# EAGLE design yin_bit (EAGLE 9.4.2)
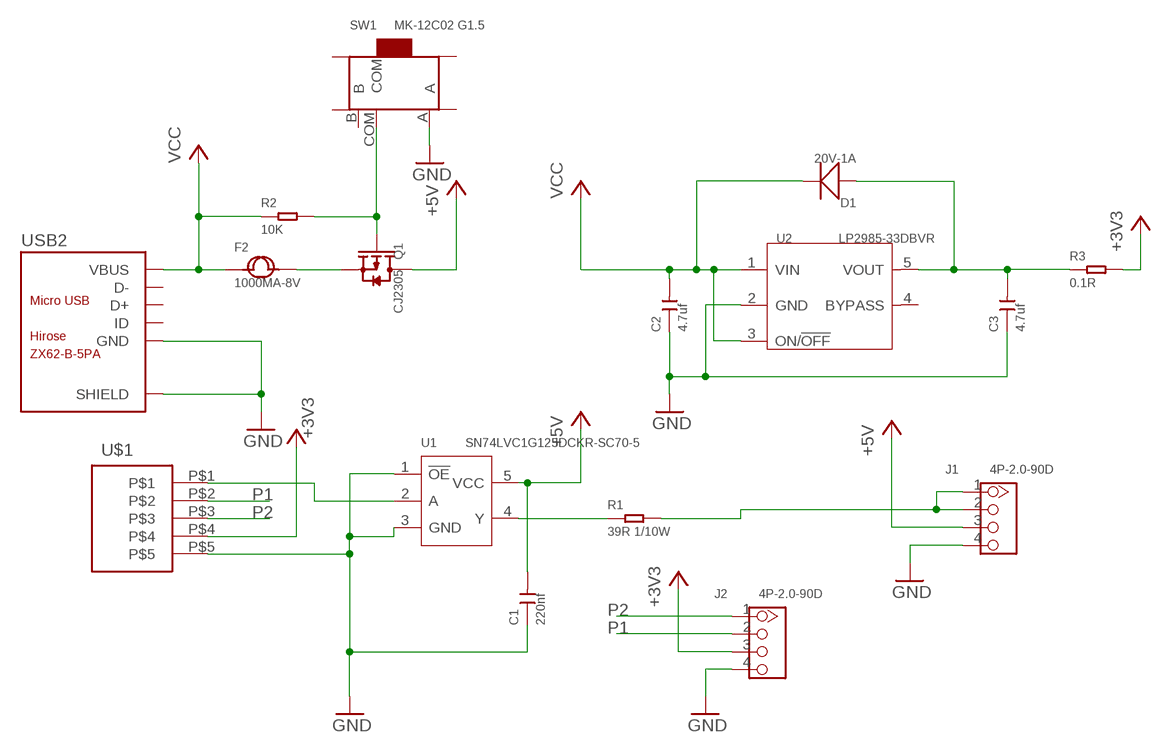
[diagram p0: schematic, sheet 1]

## Parts
C1  220nf  CERAMIC-220NF-25V-10%-X7R(0603)  [C0603]
C2  4.7uf  CERAMIC-4.7UF-10V-10%-X5R(0603)  [C0603]
C3  4.7uf  CERAMIC-4.7UF-10V-10%-X5R(0603)  [C0603]
D1  20V-1A  SMD-DIODE-SCHOTTKY-20V-1A(SOD-123)  [SOD-123]
F2  1000MA-8V  SMD-PPTC-1000MA-8V(1206)  [F1206]
J1  4P-2.0-90D  GROVE-CONNECTOR-DIP-90D(4P-2.0)  [HW4-2.0-90D]
J2  4P-2.0-90D  GROVE-CONNECTOR-DIP-90D(4P-2.0)  [HW4-2.0-90D]
Q1  CJ2305  SMD-MOSFET-P-CH-8V-4.1A-CJ2305(SOT-23)  [SOT-23]
R1  39R 1/10W  SMD-RES-39R-5%-1/10W(0603)  [R0603]
R2  10K  SMD-RES-10K-1%-1/10W(0603)  [R0603]
R3  0.1R  SMD-RES-0.1R-5%-1/8W(0805)  [R0805]
SW1  MK-12C02 G1.5  SMD-TOGGLE-SWITCH-ON-ON(3+4P-6.7X2.7MM)  [SW7-SMD-L6.7X2.7X3.2MM]
U1  SN74LVC1G125DCKR-SC70-5  LOGIC-SN74LVC1G125DCKR(SC70-5)  [SC-70-5]
U2  LP2985-33DBVR  PMIC-LP2985-33DBVR(SOT23-5)  [SOT-23-5]
U$1  MICROBIT-HOLL  [MICROBIT-HOLL]
USB2  ZX62-B-5PA  MICRO-USB-SMD(ZX62-B-5PA)  [MICRO-USB5+6P-SMD-0.65-AB]

## Nets
+3V3: J2.3 R3.2 U$1.P$4
+5V: C1.2 J1.3 Q1.3(D) U1.5(VCC)
GND: C1.1 C2.1 C3.1 J1.4 J2.4 SW1.A U1.1(!OE!) U1.3(GND) U2.2(GND) U$1.P$5 USB2.5(GND) USB2.P1(SHIELD) USB2.P2(SHIELD) USB2.P3(SHIELD) USB2.P4(SHIELD) USB2.P5(SHIELD) USB2.P6(SHIELD)
N$1: U1.2(A) U$1.P$1
N$2: R1.1 U1.4(Y)
N$3: J1.1 J1.2 R1.2
N$4: Q1.1(G) R2.2 SW1.COM
N$5: F2.2 Q1.2(S)
N$6: C3.2 D1.+ R3.1 U2.5(VOUT)
P1: J2.2 U$1.P$2
P2: J2.1 U$1.P$3
VCC: C2.2 D1.- F2.1 R2.1 U2.1(VIN) U2.3(ON/!OFF) USB2.1(VBUS)
Unconnected: SW1.B SW1.SS1 SW1.SS2 SW1.SS3 SW1.SS4 U2.4(BYPASS) USB2.2(D-) USB2.3(D+) USB2.4(ID)

## Library data of the parts
C1 = Seeed-Capacitor:CERAMIC-220NF-25V-10%-X7R(0603): 302010073; MPN: CC0603KRX7R8BB224
C2 C3 = Seeed-Capacitor:CERAMIC-4.7UF-10V-10%-X5R(0603): 302010111; MPN: CC0603KRX5R6BB475
D1 = Seeed-Diode:SMD-DIODE-SCHOTTKY-20V-1A(SOD-123): 304020034; MPN: B5819W
F2 = Seeed-Fuse:SMD-PPTC-1000MA-8V(1206): 307010001; MPN: KT8-1000SMD1206
J1 J2 = Seeed-Connector:GROVE-CONNECTOR-DIP-90D(4P-2.0): 320110034
Q1 = Seeed-Transistor:SMD-MOSFET-P-CH-8V-4.1A-CJ2305(SOT-23): 305030014; MPN: CJ2305
R1 = Seeed-OPL-Resistor:SMD-RES-39R-5%-1/10W(0603): 301010138; MPN: RC0603JR-0739RL
R2 = Seeed-Resistor:SMD-RES-10K-1%-1/10W(0603): 301010299; MPN: RC0603FR-0710KL
R3 = Seeed-Resistor:SMD-RES-0.1R-5%-1/8W(0805): 301010264; MPN: RL0805JR-070R1L
SW1 = Seeed-Switch:SMD-TOGGLE-SWITCH-ON-ON(3+4P-6.7X2.7MM): 311030001; MPN: MK-12C02 G1.5
U1 = Seeed-OPL-ic:LOGIC-SN74LVC1G125DCKR(SC70-5): 310050019; MPN: SN74LVC1G125DCKR
U2 = Seeed-OPL-ic:PMIC-LP2985-33DBVR(SOT23-5): 310030033; MPN: LP2985-33DBVR
U$1 = Seeed-Connector:MICROBIT-HOLL
USB2 = Seeed-OPL-Connector:MICRO-USB-SMD(ZX62-B-5PA): 320010005; MPN: ZX62-B-5PA

## Board
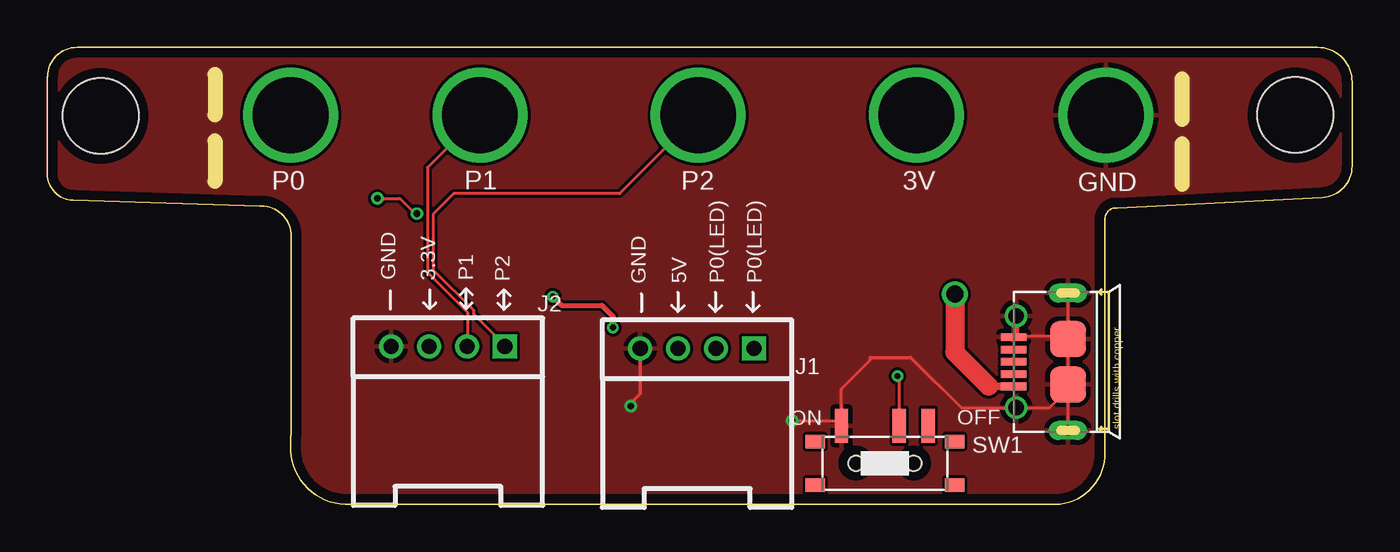
[diagram p1: board, top side]
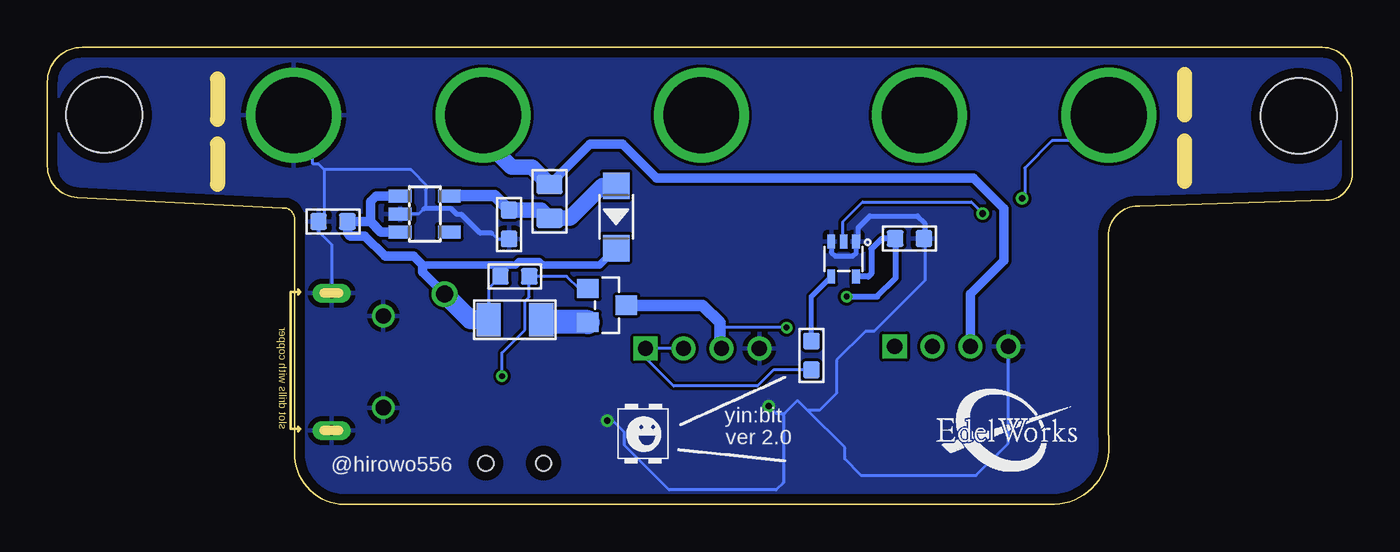
[diagram p2: board, bottom side, seen from below]

Size 68.89 x 24.15 mm. Coordinates in mm from the lower left corner, seen from the top.
Outline: 55.85,14.14 55.85,15.1 arc-90 56.42,15.66 56.51,15.66 67.33,16.22 arc87 68.9,17.87 68.9,22.32 arc90 67.07,24.15 1.57,24.15 arc90 0.01,22.59
Outline: 12.87,14.19 arc90 11.31,15.75 11.2,15.75 1.35,16.07 arc-88 0,17.46 0,22.6 0.02,22.6
Outline: 12.87,14.17 12.87,3.65
Outline: 12.86,3.65 12.86,3.09 arc90 15.72,0 53.22,0
Outline: 55.85,14.12 55.85,2.74 arc-90 53.22,0
Copper layers (1*16): Top 0.035mm / dielectric 1.6mm / Bottom 0.035mm
Design rules "Elecrow_2-layer_PCB_eagle_rule": minimum track width 6mil, minimum drill 12mil, track to track 6mil, track to pad 6mil, pad to pad 6mil, via to via 8mil, smd to smd 0mil, copper to edge 20mil, drill to drill 10mil, minimum pad ring 6mil, minimum via ring 6mil, stop-mask expansion 0mil, vias tented up to drill 100mil, thermal gap 10mil
Holes 4 mm at 2.81,20.52 65.89,20.57
Milling: 4 lines

### Footprints (pad centres in the part's own frame; a part is rotated, then mirrored left to right if it is on the bottom)
C0603 = smd 0.889 x 0.889: 1 0,0.762; 2 0,-0.762
SOD-123 = smd 1.397 x 1.397: + -1.651,0; - 1.651,0
F1206 = smd 1.27 x 1.778: 1 -1.397,0; 2 1.397,0
HW4-2.0-90D = drill 0.8 pad 1.27 square: 1 -3,0 | drill 0.8 pad 1.27: 2 -1,0; 3 1,0; 4 3,0
SOT-23 = smd 1.016 x 1.143: 1 -0.889,-1.016; 2 0.889,-1.016; 3 0,1.016
R0603 = smd 0.889 x 0.889: 1 0,0.762; 2 0,-0.762
R0805 = smd 1.397 x 1.016: 1 0,0.889; 2 0,-0.889
SW7-SMD-L6.7X2.7X3.2MM = smd 1.8 x 0.7: A 1.978,2.286; B 1.978,-2.286; COM 1.978,-0.762 | smd 0.7 x 1.016: SS1 -1.15,-3.683; SS2 1.15,-3.683; SS3 1.15,3.683; SS4 -1.15,3.683 | hole 0.813: 0,-1.524; 0,1.524
SC-70-5 = smd 0.4 x 0.75: 1 -0.65,-0.925; 2 0,-0.925; 3 0.65,-0.925; 4 0.65,0.925; 5 -0.65,0.925
SOT-23-5 = smd 0.69 x 1.2: 1 -0.95,-1.3; 2 0,-1.3; 3 0.95,-1.3; 4 0.95,1.3; 5 -0.95,1.3
MICROBIT-HOLL = drill 4: P$1 -11.43,0; P$2 -1.43,0; P$3 10.094,0; P$4 21.618,0; P$5 31.618,0
MICRO-USB5+6P-SMD-0.65-AB = smd 0.4 x 1.35: 1 -1.3,2.875; 2 -0.65,2.875; 3 0,2.875; 4 0.65,2.875; 5 1.3,2.875 | smd 1.9 x 1.9: P1 -1.2,0; P2 1.2,0 | drill 0.508 pad 1.016 long: P3 -3.625,0; P4 3.625,0 | drill 0.8: P5 -2.425,2.73; P6 2.425,2.73

### Placement (x,y rotation side)
C1  23.37,14.04 270 bottom
C2  53.81,14.94 90 bottom
C3  44.52,14.79 180 bottom
D1  38.86,15.19 270 bottom
F2  44.21,9.76 0 bottom
J1  34.31,8.23 180 top
J2  21.16,8.34 180 top
Q1  39.33,10.52 270 bottom
R1  28.55,7.86 0 bottom
R2  44.21,12.04 90 bottom
R3  42.38,16 180 bottom
SW1  44.22,2.17 90 top
U1  26.85,12.96 180 bottom
U2  48.97,15.34 270 bottom
U$1  24.27,20.56 0 top
USB2  53.89,7.53 90 top

### Tracks (layer width: path | path; a pad name or v marks a point on that pad's centre or on a via)
+3V3
  Bottom 0.508: R3.2 40.25,19.02 38.53,19.02 36.73,17.23 19.99,17.23 18.38,15.62 18.38,12.88 20.16,11.1 J2.3
  Bottom 0.813: U$1.P$4 45.89,19.31 44.39,17.81 43.3,17.81 R3.2
+5V  (via drill 0.3)
  Top 0.254: v26.69,10.98 27.14,10.52 29.28,10.52 29.87,9.93 v29.87,9.34
  Bottom 0.152: v29.87,9.34 33.2,9.34 33.39,9.15
  Bottom 0.305: v26.69,10.98 25.09,10.98 24.09,11.97 24.09,14.01 C1.2 24.84,14.04 25.39,13.49 25.39,12.19 25.55,12.04 U1.5
  Bottom 0.61: Q1.3 34.31,10.52 33.39,9.6 33.39,9.15 33.39,8.32 J1.3
GND  (via drill 0.35)
  Top 0.152: USB2.P2 53.89,8.69 | 53.89,8.69 USB2.P1 53.89,6.1 | 53.89,6.1 USB2.P3 | 53.89,6.1 52.9,5.11 USB2.P5 48.25,5.11 45.58,7.78 43.45,7.78 43.45,7.62 41.93,6.11 41.93,4.27 | 51.16,8.9 53.67,8.9 53.77,8.8 | 53.77,8.8 53.89,8.69 | USB2.P4 53.89,8.92 53.77,8.8 | SW1.A 41.93,4.27 | J1.4 31.31,5.84 30.8,5.34 v30.8,5.18 | v39.33,4.42 41.78,4.42 41.93,4.27
  Top 0.254: USB2.P6 51.16,8.9 51.08,8.9 USB2.5
  Bottom 0.152: U$1.P$5 54.88,20.28 54.88,17.99 54.57,17.99 54.27,17.68 | U2.2 49.29,15.34 49.01,15.62 48.94,15.7 48.94,16.61 48.78,16.77 49.7,17.68 54.27,17.68 | 45.43,14.33 45.13,14.02 C3.1 | 29.96,4.8 29.28,5.49 28.76,4.97 | 29.96,4.8 30.04,4.73 30.04,1.15 30.42,0.76 36.06,0.76 38.42,3.13 38.42,3.81 39.03,4.42 v39.33,4.42 | 54.27,17.68 54.27,15.24 C2.1 54.57,14.42 53.89,13.73 USB2.P4 | 28.76,4.97 26.79,3.01 26.79,2.4 25.92,1.53 19.86,1.53 18.16,3.23 J2.4 | 22.57,14.08 22.57,11.81 25.24,9.15 25.7,9.15 27.22,7.62 27.22,5.87 28.12,4.97 28.76,4.97 | v30.8,5.18 30.42,4.8 29.96,4.8
  Bottom 0.254: U1.1 26.19,13.87 | U1.3 27.5,13.32 27.3,13.11 26.38,13.11 26.19,13.3 26.19,13.87 | 45.43,14.33 46.04,14.33 47.03,15.32 47.26,15.32 47.57,15.62 49.01,15.62 | 26.19,13.87 26.08,13.98 26.08,14.63 25.47,15.24 22.95,15.24 22.57,14.86 22.57,14.08 C1.1
  pour Top: -2.42,-2.28 -2.42,24.84 70.73,24.84 70.73,-2.28
  pour Bottom: -2.42,-3.05 -2.42,24.84 71.49,24.84 71.49,-3.05
N$1  (via drill 0.35)
  Top 0.152: v17.42,16.16 18.62,16.16 19.42,15.36 v19.51,15.36
  Bottom 0.152: U$1.P$1 14.2,19.21 15.85,19.21 17.28,17.77 17.28,16.3 v17.42,16.16 | v19.51,15.36 20.11,15.97 25.85,15.97 26.9,14.92 26.9,13.94 U1.2
N$2
  Bottom 0.254: R1.1 28.55,10.99 U1.4
N$3
  Bottom 0.152: R1.2 30.56,7.1 31.41,6.25 35.83,6.25 37.31,7.73 J1.1 J1.2
N$4  (via drill 0.3)
  Top 0.152: SW1.COM 44.98,6.68 v44.89,6.78
  Bottom 0.152: v44.89,6.78 44.89,8.01 43.68,9.22 43.68,10.74 43.45,10.97 R2.2 41.47,12.04 40.83,11.41 Q1.1
N$5
  Bottom 1.27: Q1.2 42.79,9.63 42.68,9.74 42.69,9.76 F2.2
N$6
  Bottom 0.61: C3.2 45.28,16.31 47.65,16.31 U2.5
  Bottom 0.813: C3.2 42.81,15.55 R3.1 41.29,15.12 39.57,16.84 D1.+
P1
  Top 0.152: U$1.P$2 20.07,17.8 20.07,12.25 22.19,10.14 22.19,8.38 J2.2
P2
  Top 0.152: U$1.P$3 30.21,16.41 21.46,16.41 20.38,15.33 20.38,12.38 22.49,10.26 22.49,10.06 24.16,8.4 J2.1
VCC  (via drill 0.9)
  Top 0.406: USB2.1 49.72,6.23 49.7,6.25
  Top 1.016: v47.92,11.1 47.92,8.03 49.7,6.25
  Bottom 0.152: R2.1 45.61,11.41 F2.1
  Bottom 0.406: D1.- 39.74,12.65 42.73,12.65 42.92,12.84 43.98,12.84 44.17,12.65 49.09,12.65
  Bottom 0.508: v47.92,11.1 49.09,12.27 49.09,12.65 49.55,13.11 51.07,13.11 52.14,14.18 52.9,14.18 53.05,14.33 C2.2 51.83,14.94 | U2.3 51.29,14.39 51.83,14.94 | U2.1 51.54,16.29 51.83,16 51.83,14.94
  Bottom 1.016: v47.92,11.1 46.57,9.76 F2.1

### Text on the board
tPlace: ON | OFF
bPlace: yin:bit | ver 2.0
tNames: P0 | P1 | P2 | 3V | GND | GND | 3.3V | P1 | P2 | GND | 5V | P0(LED) | P0(LED)
bNames: @hirowo556